# Altium schematic sheet Power Supplies.SchDoc
size A
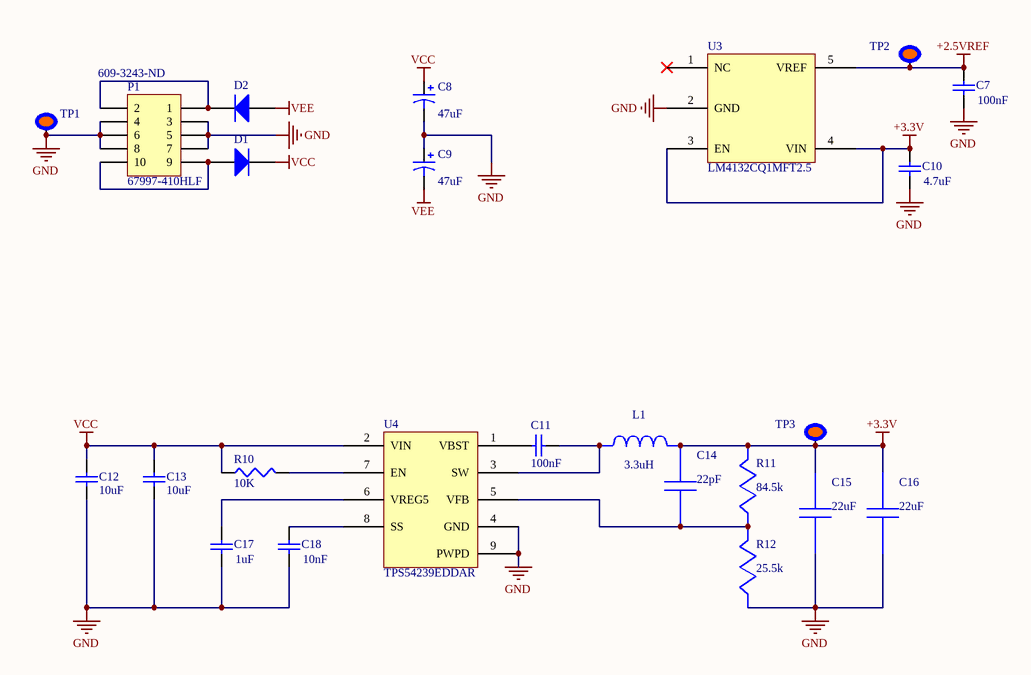
[diagram p0: Power Supplies.SchDoc]

## Parts
C7  value 100nF  [RES_0603]  (hidden comment: 06035G104ZAT2A)
C8  value 47uF  [CAPAE_UW_J_6.3mm]  (hidden comment: EEE-FK1V470P)
C9  value 47uF  [CAPAE_UW_J_6.3mm]  (hidden comment: EEE-FK1V470P)
C10  value 4.7uF  [RES_0805]  (hidden comment: CL21A475KACLRNC)
C11  value 100nF  [RES_0603]  (hidden comment: 06035G104ZAT2A)
C12  value 10uF  [RES_1206]  (hidden comment: GRT31CR61H106ME01L)
C13  value 10uF  [RES_1206]  (hidden comment: GRT31CR61H106ME01L)
C14  value 22pF  [RES_0603]  (hidden comment: C0603C220J5GACTU)
C15  value 22uF  [RES_0805]  (hidden comment: CL21A226KPCLRNC)
C16  value 22uF  [RES_0805]  (hidden comment: CL21A226KPCLRNC)
C17  value 1uF  [RES_0603]  (hidden comment: CL10A105KA8NNNC)
C18  value 10nF  [RES_0603]  (hidden comment: CL10B103KB8NCNC)
D1  1N5819HW-7-F  [SOD123]  (value not drawn)
D2  1N5819HW-7-F  [SOD123]  (value not drawn)
L1  value 3.3uH  [INDPM6060X450N]  (hidden comment: VLS6045EX-3R3N)
P1  67997-410HLF  Supplier Part Number 1: 609-3243-ND  [HDR2X5]
R10  value 10K  [RES_0805]  (hidden comment: RR1220P-103-D)
R11  value 84.5k  [RES_0603]  (hidden comment: ERA-3AEB8452V)
R12  value 25.5k  [RES_0603]  (hidden comment: ERA-3AEB2552V)
TP1  loop test point  [Test Point Mt Hole]  (value not drawn)
TP2  loop test point  [Test Point Mt Hole]  (value not drawn)
TP3  loop test point  [Test Point Mt Hole]  (value not drawn)
U3  LM4132CQ1MFT2.5  [LM4132CQ1MFT2.5]
U4  TPS54239EDDAR  [DDA]

## Nets
+2.5VREF: C7.2 TP2.1 U3.5(VREF)
+3.3V: C10.2 C14.1 C15.1 C16.1 L1.1 R11.1 TP3.1 U3.3(EN) U3.4(VIN)
GND: C7.1 C8.2 C9.1 C10.1 C12.2 C13.2 C15.2 C16.2 C17.1 C18.1 P1.3 P1.4 P1.5 P1.6 P1.7 P1.8 R12.2 TP1.1 U3.2(GND) U4.4(GND) U4.9(PWPD)
VCC: C8.1 C12.1 C13.1 D1.2(K) R10.1 U4.2(VIN)
VEE: C9.2 D2.1(A)
NetC11_1: C11.1 L1.2 U4.3(SW)
NetC11_2: C11.2 U4.1(VBST)
NetC14_2: C14.2 R11.2 R12.1 U4.5(VFB)
NetC17_2: C17.2 U4.6(VREG5)
NetC18_2: C18.2 U4.8(SS)
NetD1_1: D1.1(A) P1.9 P1.10
NetD2_2: D2.2(K) P1.1 P1.2
NetR10_2: R10.2 U4.7(EN)

Not connected (* = marked no-connect by the designer): U3 1(NC)*

## Library data of the parts
C7 C11 = Cap: Capacitor; Manufacturer: AVX Corporation; Manufacturer Part Number: 06035G104ZAT2A; Supplier 1: Digi-Key; Supplier Part Number 1: 478-3724-1-ND
C8 C9 = Cap Pol3: Polarized Capacitor (Surface Mount); Manufacturer: Panasonic; Manufacturer Part Number: EEE-FK1V470P; Supplier 1: Digi-Key; Supplier Part Number 1: PCE3842CT-ND
C10 C17 C18 = Cap: Capacitor; Manufacturer: Samsung Electro-Mechanics; Supplier 1: Digi-Key
  C10: Manufacturer Part Number: CL21A475KACLRNC; Supplier Part Number 1: 1276-2415-1-ND
  C17: Manufacturer Part Number: CL10A105KA8NNNC; Supplier Part Number 1: 1276-1102-1-ND
  C18: Manufacturer Part Number: CL10B103KB8NCNC; Supplier Part Number 1: 1276-1921-1-ND
C12 C13 = Cap: Capacitor; Manufacturer: Murata; Supplier 1: Digi-Key; Supplier Part Number 1: 490-12457-1-ND; Manufacturer Part Number: GRT31CR61H106ME01L
C14 = GJM0335C0J220JB01D: Capacitor; Manufacturer: KEMET; Manufacturer Part Number: C0603C220J5GACTU; Supplier 1: Digi-Key; Supplier Part Number 1: 399-1053-1-ND
C15 C16 = C2012X5R1V226M125AC: Capacitor; Manufacturer: Samsung Electro-Mechanics; Manufacturer Part Number: CL21A226KPCLRNC; Supplier 1: Digi-Key; Supplier Part Number 1: 1276-6786-1-ND
D1 D2 = Diode: Default Diode; Manufacturer: Diodes Incorporated; Manufacturer Part Number: 1N5819HW-7-F; Supplier 1: Digi-Key; Supplier Part Number 1: 1N5819HW-FDICT-ND
L1 = CLF7045T-3R3N: Inductor; Manufacturer: TDK; Manufacturer Part Number: VLS6045EX-3R3N; Supplier 1: Mouser; Supplier Part Number 1: 810-VLS6045EX-3R3N
P1 = Header 5X2: Header, 5-Pin, Dual row; Manufacturer: Amphenol FCI; Manufacturer Part Number: 67997-410HLF; Supplier 1: Digi-Key
R10 = Res3: Resistor; Manufacturer: Susumu; Manufacturer Part Number: RR1220P-103-D; Supplier 1: Digi-Key; Supplier Part Number 1: RR12P10.0KDCT-ND
R11 = CRCW040284K5FKED: Resistor; Manufacturer: Panasonic Electronic Components; Manufacturer Part Number: ERA-3AEB8452V; Supplier 1: Digi-Key; Supplier Part Number 1: P84.5KDBCT-ND
R12 = CRCW040225K5FKED: Resistor; Manufacturer: Panasonic Electronic Components; Manufacturer Part Number: ERA-3AEB2552V; Supplier 1: Digi-Key; Supplier Part Number 1: P25.5KDBCT-ND
TP1-TP3 = 402046: Test Point Loop Miniature Keysone; Manufacturer: Keystone Electronics; Manufacturer Part Number: 5003; Supplier 1: Digi-Key; Supplier Part Number 1: 36-5003-ND
U3 = LM4132: Precision Low Dropout 2.5V Reference; Manufacturer: Texas Instruments; Supplier 1 Part Number: 296-48574-1-ND; Supplier 1: Digi-Key; Manufacturer Part Number: LM4132CQ1MFT2.5
U4 = TPS54239EDDA: 4.5V to 23V Input, 2-A Synchronous Step-Down SWIFT™ Converter With Eco-mode; Manufacturer: Texas Instruments; Manufacturer Part Number: TPS54239EDDAR; Supplier 1: Digi-Key; Supplier Part Number 1: 296-35690-1-ND